# EasyEDA Pro project ProPrj_Xen_2025-02-04.epro, schematic Controller

## Sheets
1 Teensy: Board Name: 1. XenControl; Create Date: 2025-01-25; Page Name: Teensy; Project Name: Xen; Schematic Name: Controller; Update Date: 2025-02-04; Company: EasyEDA.com; Drawn: EasyEDA; Page Size: A4; Part Number: JLCPCB-002; Reviewed: EasyEDA; Version: V0.1
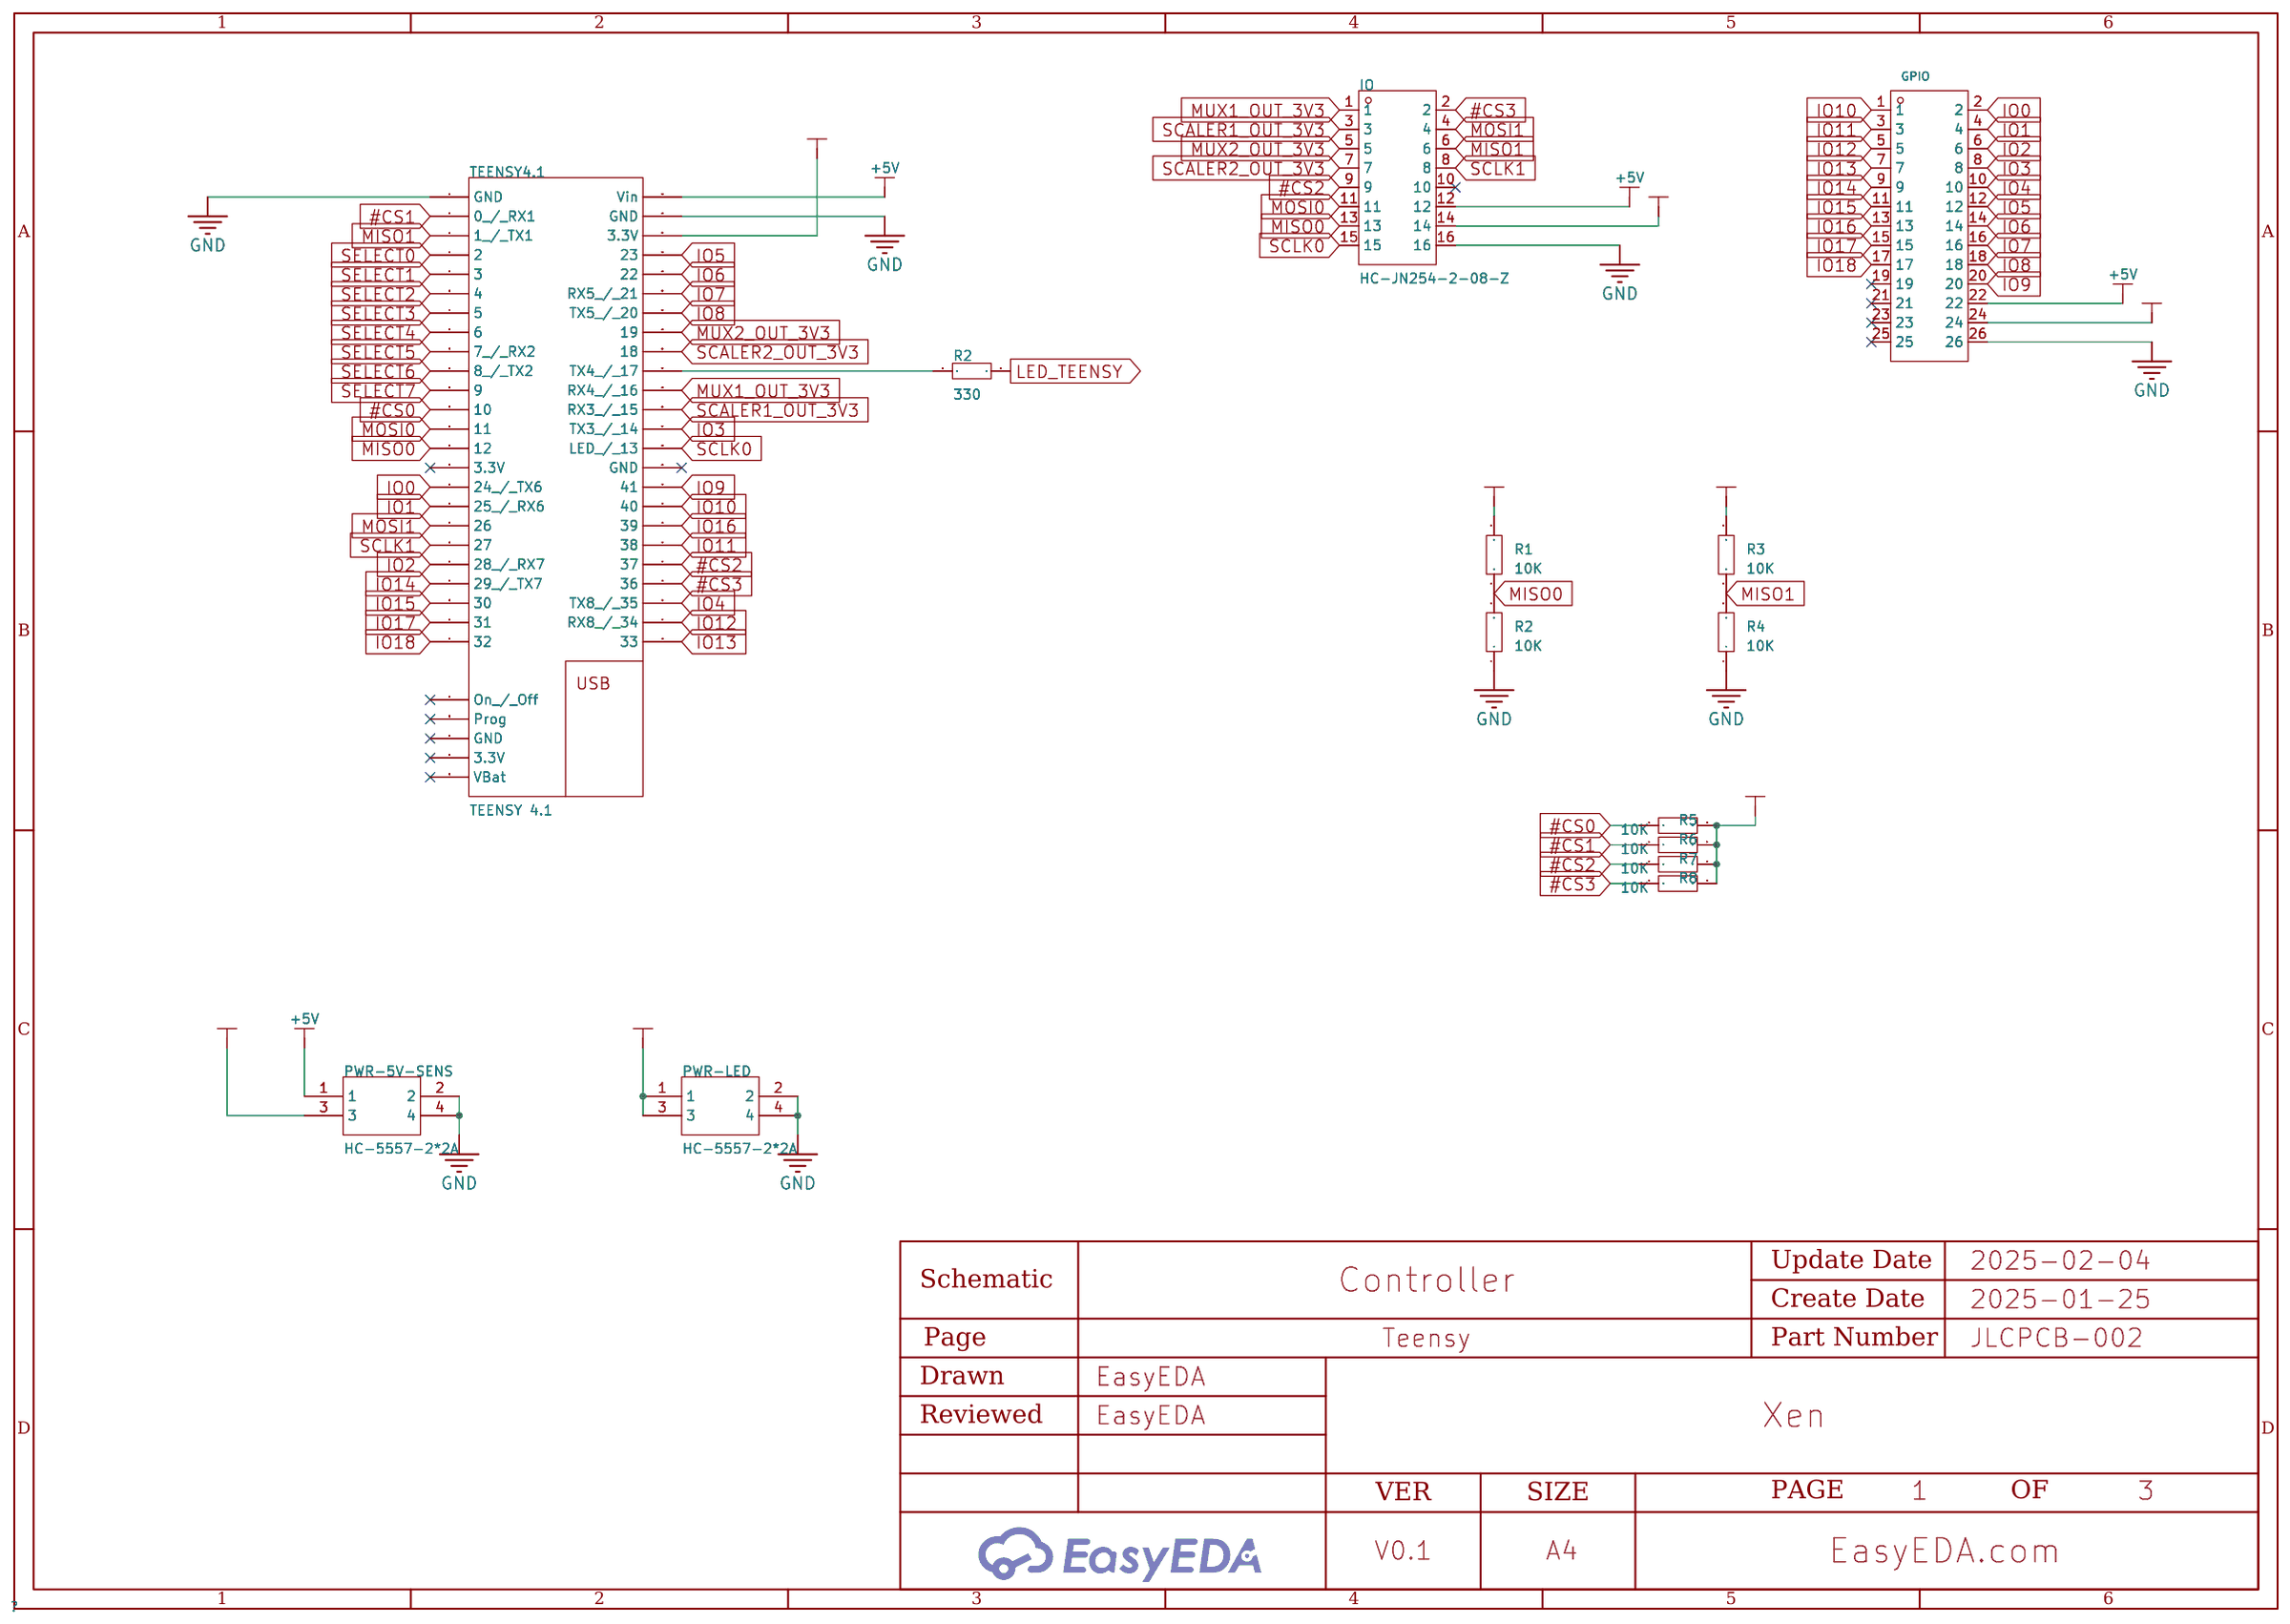
[diagram p23: Teensy]
2 Connect: Create Date: 2025-02-04; Page Name: Connect
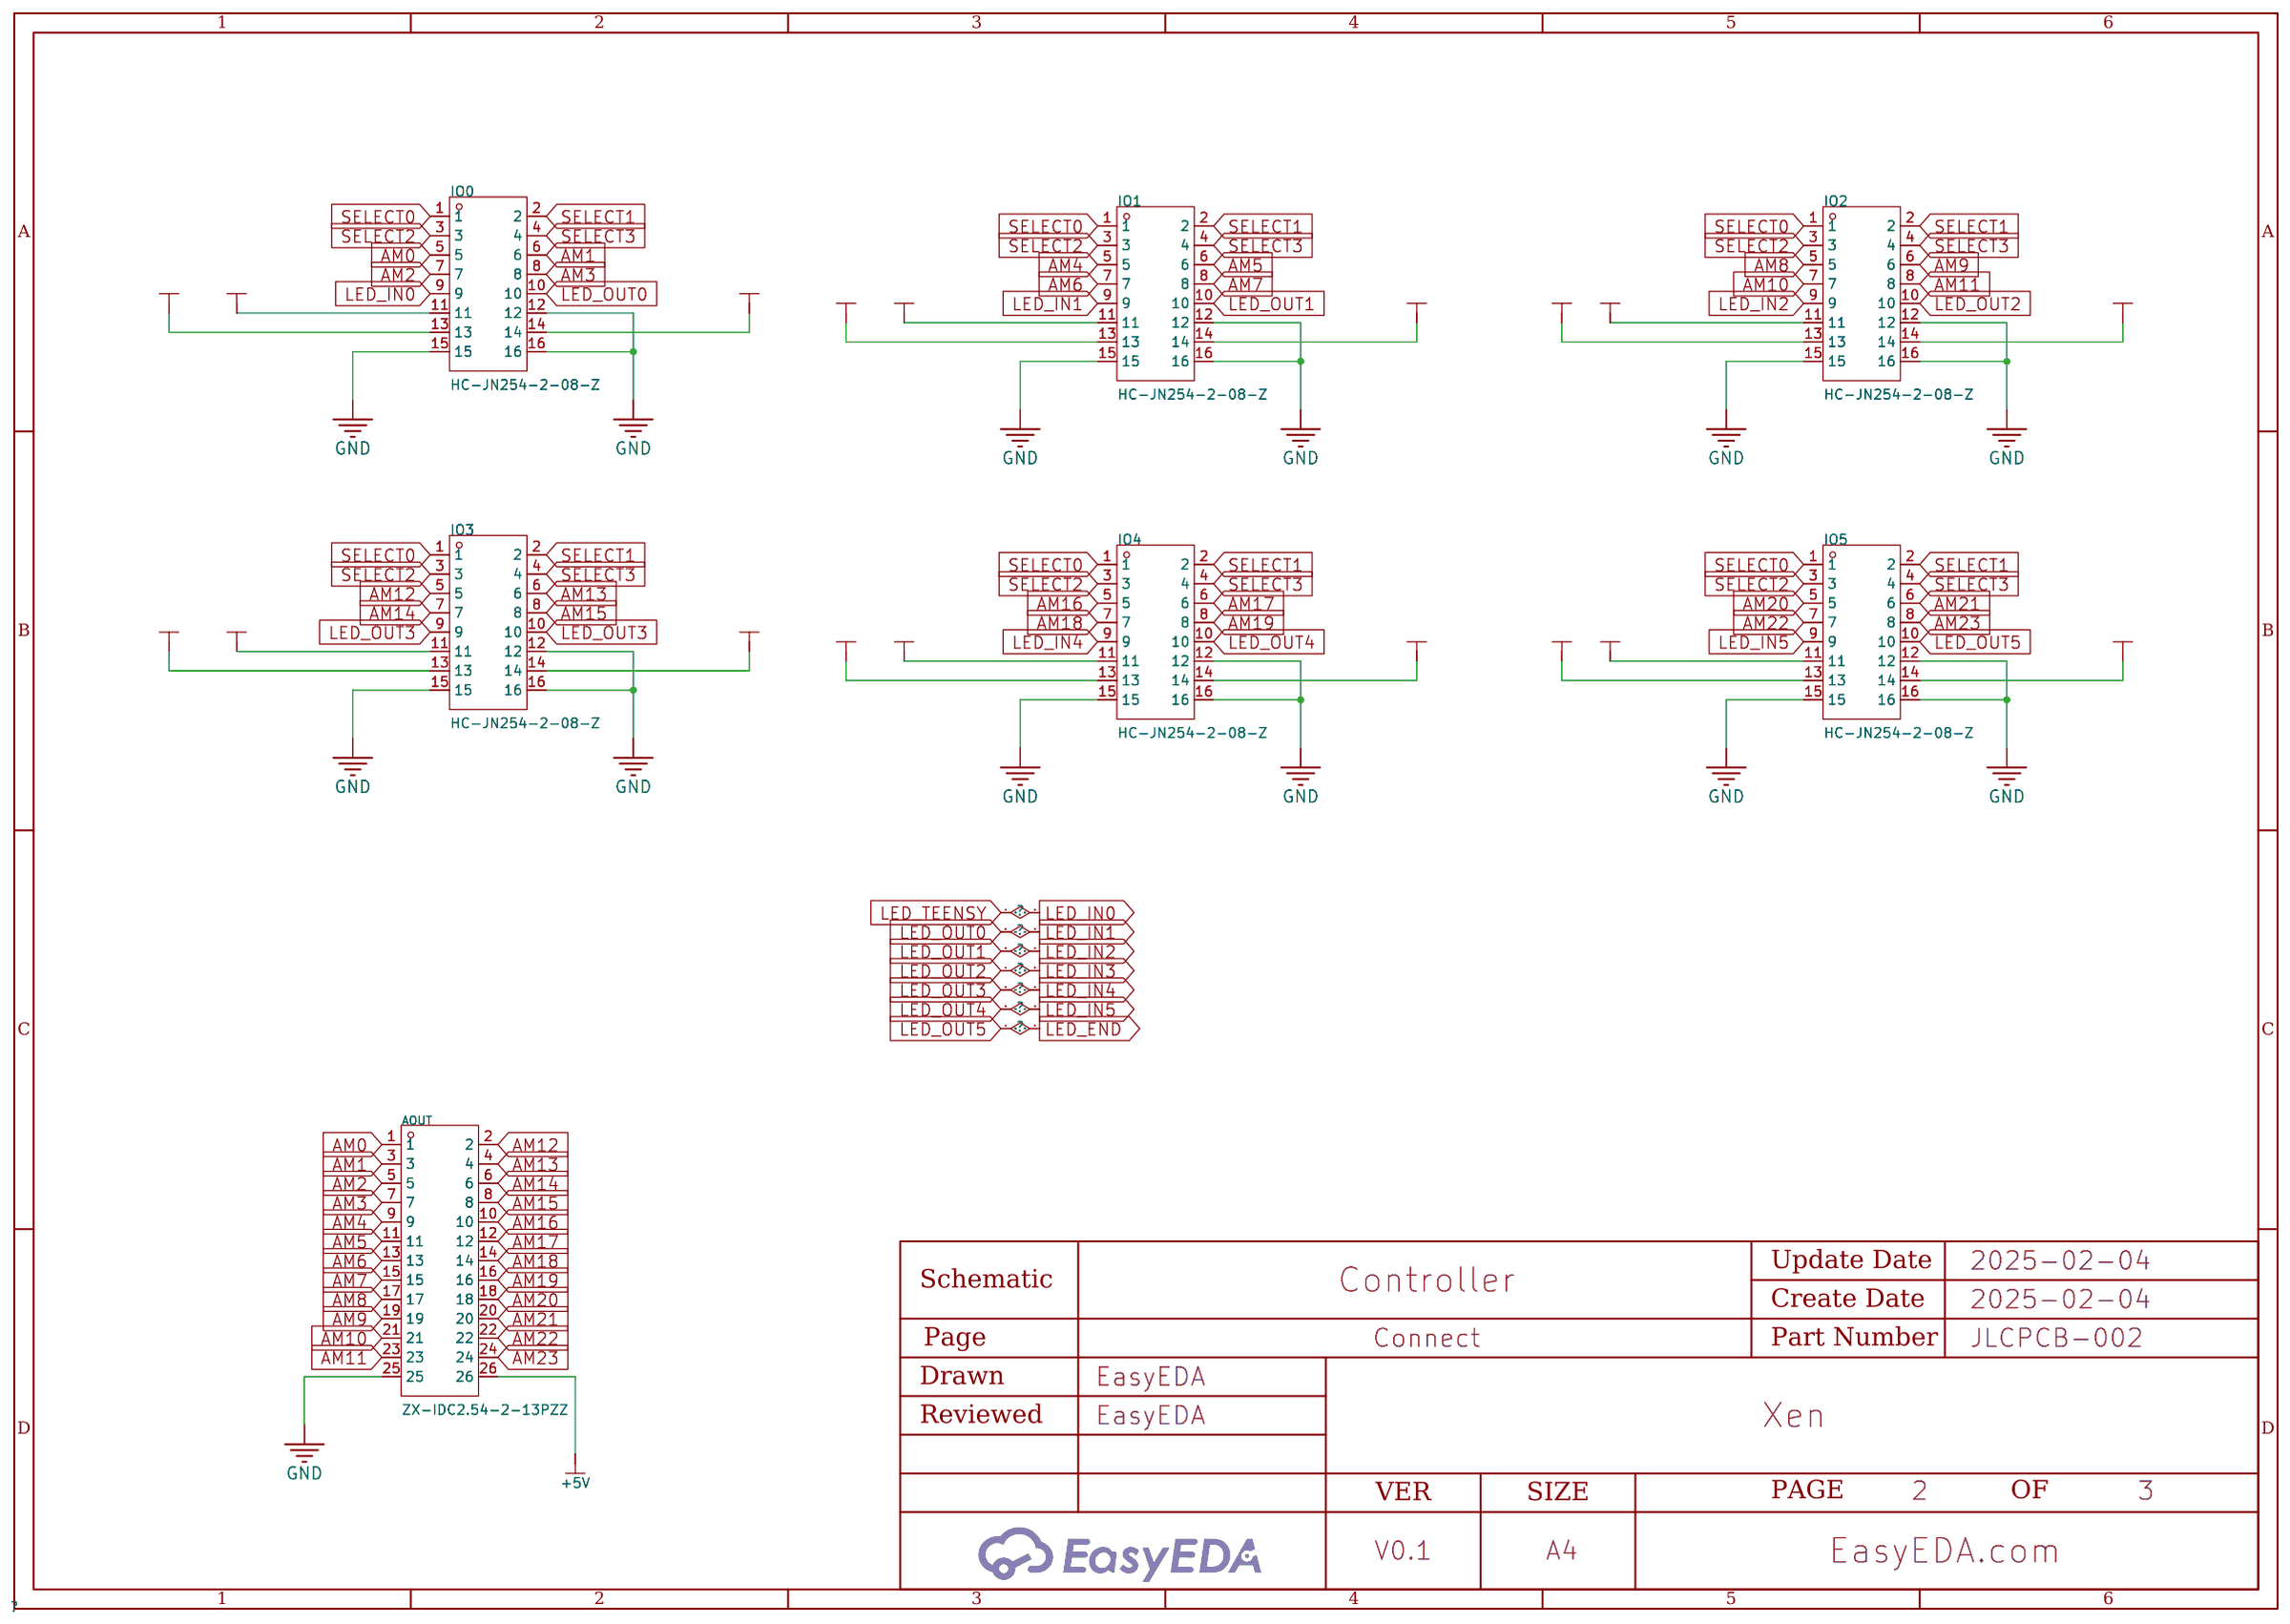
[diagram p24: Connect]
3 Mux: Create Date: 2025-02-04; Page Name: Mux
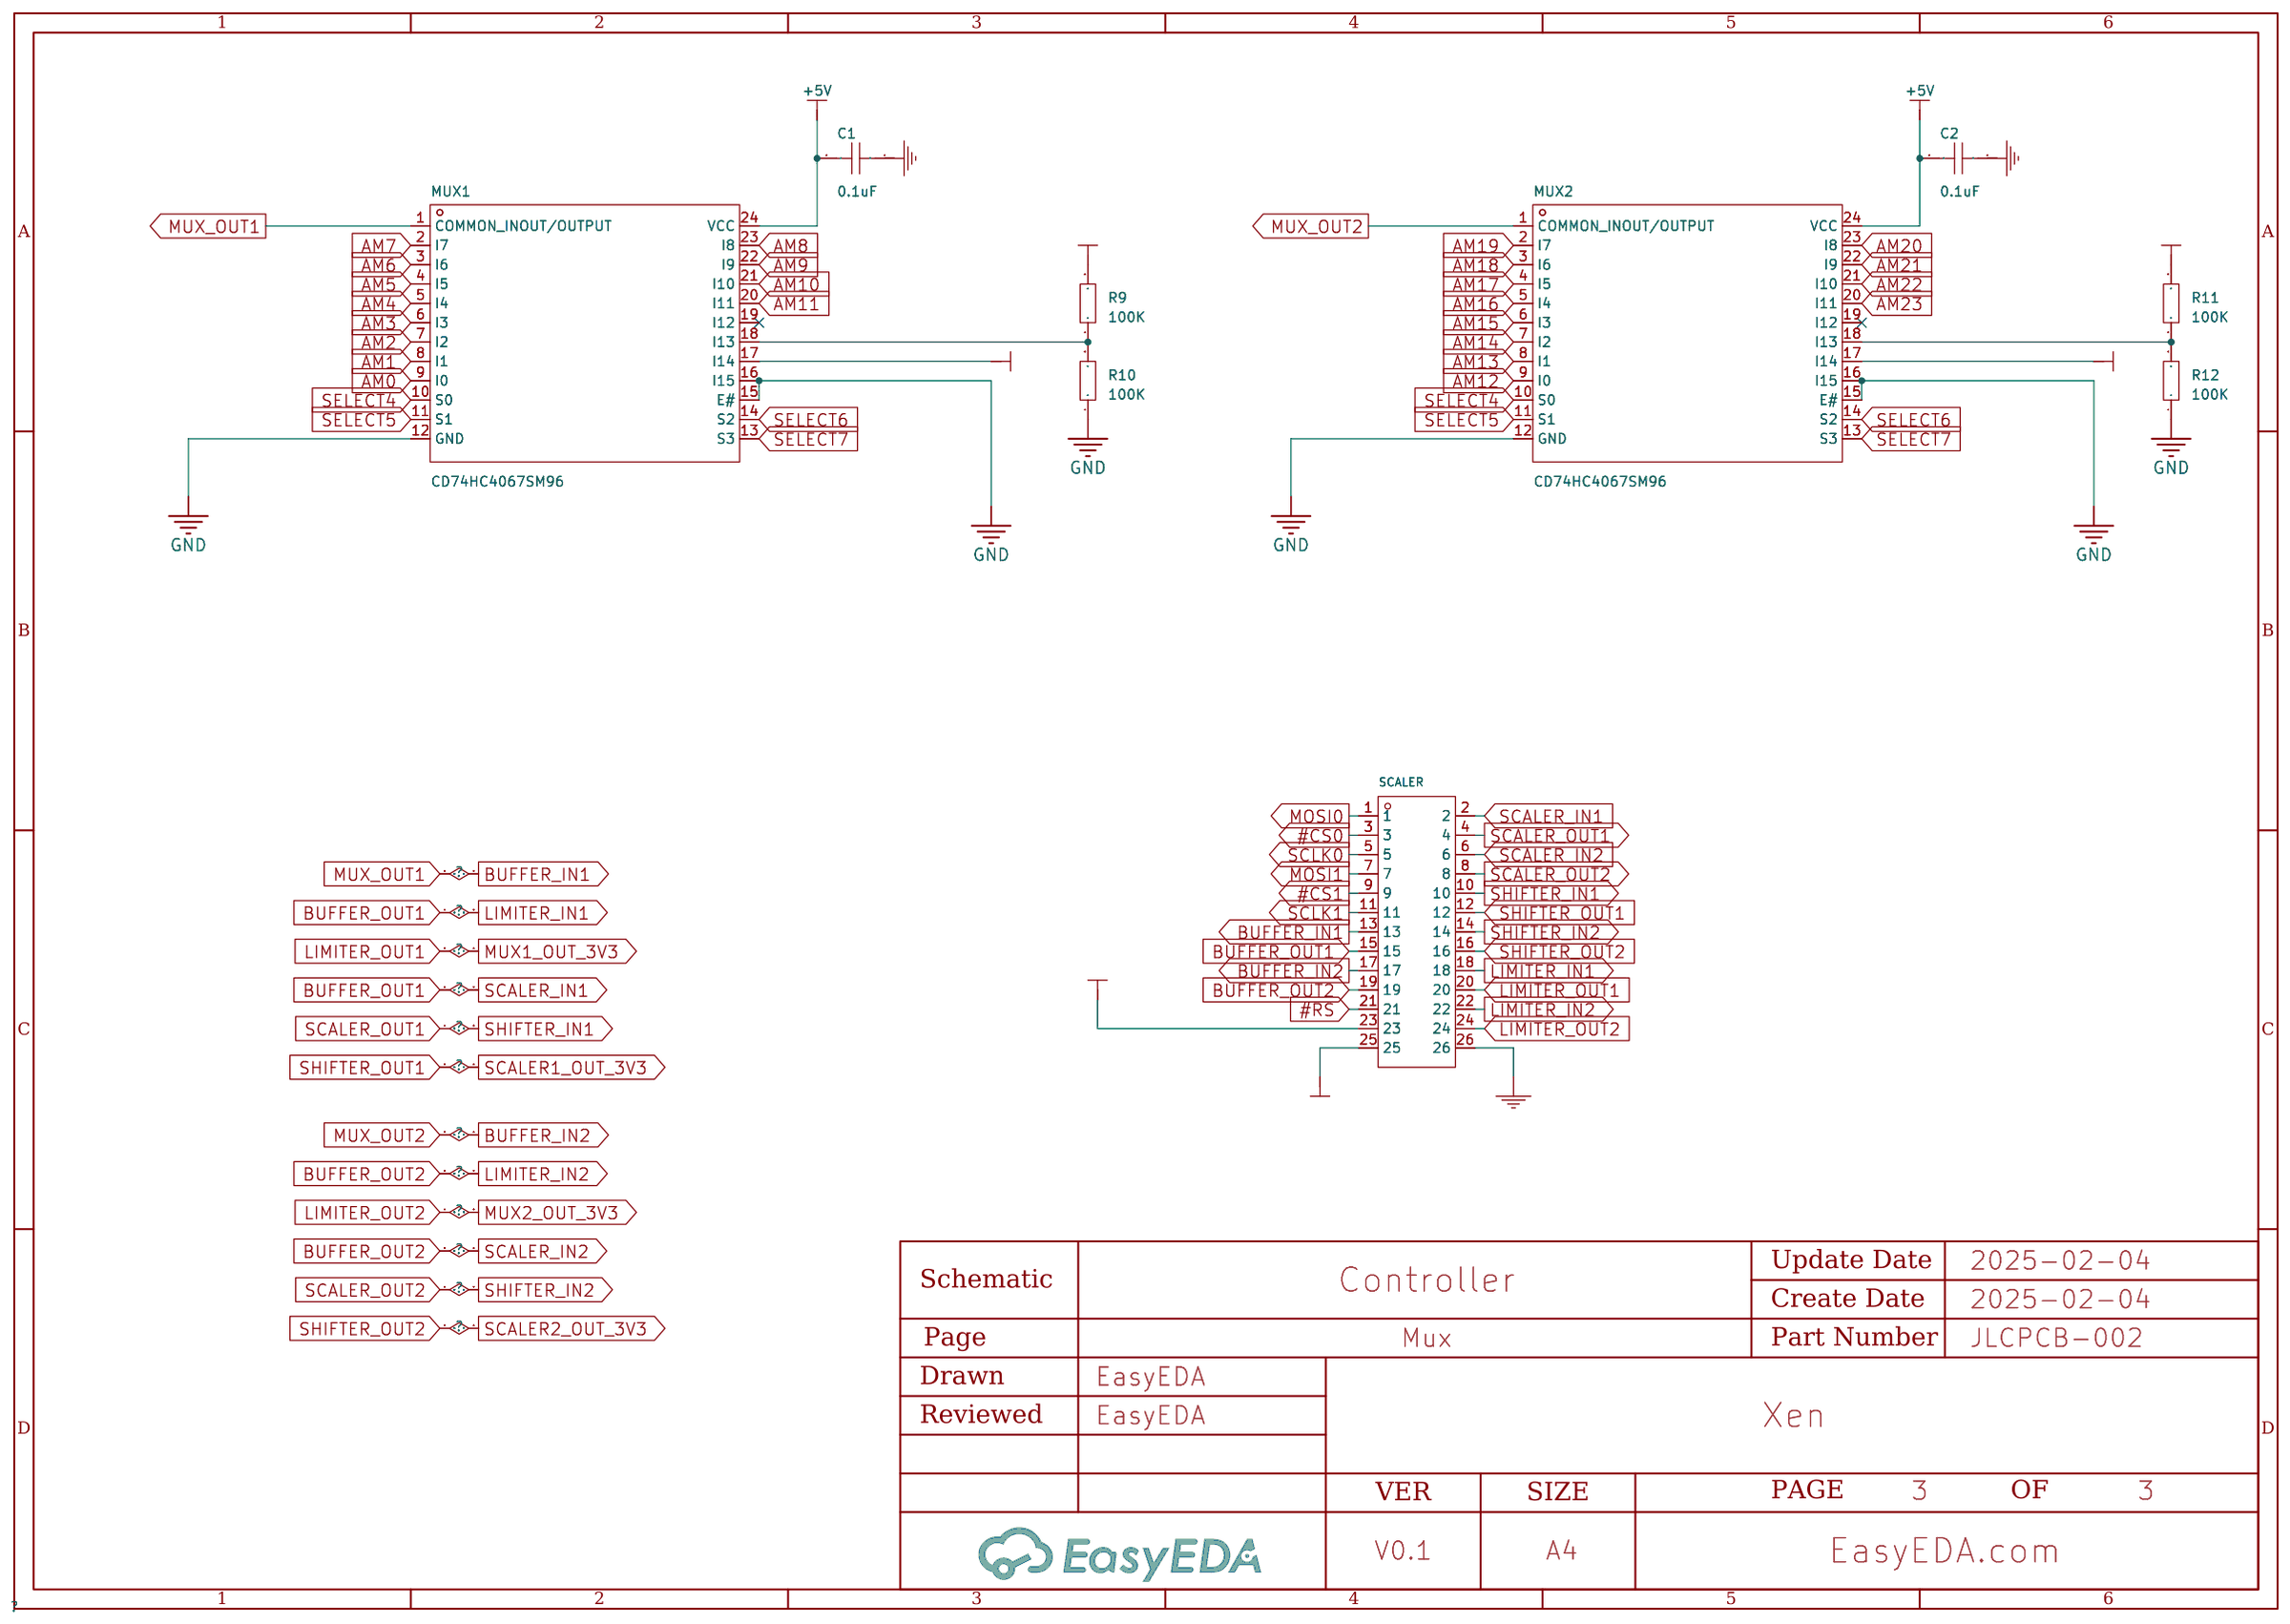
[diagram p25: Mux]

## Parts
sheet Connect
AOUT  ZX-IDC2.54-2-13PZZ  [IDC-TH_26P-P2.54_ZX-IDC2.54-2-13PZZ]
IO0  HC-JN254-2-08-Z  [CONN-TH_16P-P2.54_TE_1761681-6]
IO1  HC-JN254-2-08-Z  [CONN-TH_16P-P2.54_TE_1761681-6]
IO2  HC-JN254-2-08-Z  [CONN-TH_16P-P2.54_TE_1761681-6]
IO3  HC-JN254-2-08-Z  [CONN-TH_16P-P2.54_TE_1761681-6]
IO4  HC-JN254-2-08-Z  [CONN-TH_16P-P2.54_TE_1761681-6]
IO5  HC-JN254-2-08-Z  [CONN-TH_16P-P2.54_TE_1761681-6]
sheet Mux
C1  0.1uF  [C0603]
C2  0.1uF  [C0603]
MUX1  CD74HC4067SM96  [SSOP-24_L8.1-W5.3-P0.65-LS7.8-BL]
MUX2  CD74HC4067SM96  [SSOP-24_L8.1-W5.3-P0.65-LS7.8-BL]
R9  100K  [R0603]
R10  100K  [R0603]
R11  100K  [R0603]
R12  100K  [R0603]
SCALER  ZX-IDC2.54-2-13PZZ  [IDC-TH_26P-P2.54_ZX-IDC2.54-2-13PZZ]
sheet Teensy
GPIO  ZX-IDC2.54-2-13PZZ  [IDC-TH_26P-P2.54_ZX-IDC2.54-2-13PZZ]
IO  HC-JN254-2-08-Z  [CONN-TH_16P-P2.54_TE_1761681-6]
PWR-5V-SENS  HC-5557-2*2A  [CONN-TH_HAA420A-4A]
PWR-LED  HC-5557-2*2A  [CONN-TH_HAA420A-4A]
R1  10K  [R0603]
R2  330  [R0603]
R2#2  10K  [R0603]
R3  10K  [R0603]
R4  10K  [R0603]
R5  10K  [R0603]
R6  10K  [R0603]
R7  10K  [R0603]
R8  10K  [R0603]
TEENSY4.1  TEENSY 4.1  [TEENSY 4.1]

## Library data of the parts
AOUT GPIO SCALER = ZX-IDC2.54-2-13PZZ: Connector Type:简牛座 Pitch:2.54mm Structure:2x13P Current Rating (Max):3A Voltage Rating (Max):1kV Holder Type:Straight Row Spacing:2.54mm Number of Rows:2 Pin Number in each Row:13 Contact Material:Brass Contact Plating:Gold Operating Temperature Range:-40; LCSC Part Name: 2.54mm 2x13P 排数:2 每排P数:13; Supplier Part: C7501247; Manufacturer: Megastar(兆星); Supplier Footprint: 插件,P=2.54mm; JLCPCB Part Class: Extended Part; Datasheet: https://atta.szlcsc.com/upload/public/pdf/source/20231122/C34A0102EBF117114DD7A9F9DEFF8982.pdf; Supplier: LCSC; Connector Type: 简牛座; Pitch: 2.54mm; Structure: 2x13P; Current Rating (Max): 3A; Voltage Rating (Max): 1kV; Holder Type: Straight; Row Spacing: 2.54mm; Number of Rows: 2; Pin Number in each Row: 13; Contact Material: Brass; Contact Plating: Gold; Operating Temperature Range: -40℃~+105℃; Soldering Temperature(Max): 260℃@10S
IO IO0-IO5 = HC-JN254-2-08-Z: Connector Type:简牛座 Pitch:2.54mm Structure:2x8P Current Rating (Max):3A Holder Type:Straight Row Spacing:2.54mm Number of Rows:2 Pin Number in each Row:8 Contact Material:Brass Contact Plating:Gold Operating Temperature Range:-40℃~+105℃ Operating Temperatu; LCSC Part Name: 2.54mm 2x8P 排数:2 每排P数:8; Supplier Part: C5372867; Manufacturer: HCTL(华灿天禄); Supplier Footprint: 插件,P=2.54mm; JLCPCB Part Class: Extended Part; Datasheet: https://atta.szlcsc.com/upload/public/pdf/source/20230316/69505B1ED1C4E6AD1FC7E030884C6E9A.pdf; Supplier: LCSC; Connector Type: 简牛座; Pitch: 2.54mm; Structure: 2x8P; Current Rating (Max): 3A; Holder Type: Straight; Row Spacing: 2.54mm; Number of Rows: 2; Pin Number in each Row: 8; Contact Material: Brass; Contact Plating: Gold; Operating Temperature Range: -40℃~+105℃; Soldering Temperature(Max): 260℃@10S
C1 C2 = CAP_0603: Supplier Footprint: 0603
MUX1 MUX2 = CD74HC4067SM96: Switch Circuit:- Number of Channels:16 Supply Voltage:2V~6V Supply Voltage:2V~6V Turn-on time:90ns On-State Resistance (Max):240Ω Turn-off time:87ns Operating Temperature:-55℃~+125℃ Operating Temperature:-55℃~+125℃; LCSC Part Name: 高速CMOS逻辑16通道模拟多路复用器/解复用器; Supplier Part: C98457; Manufacturer: TI(德州仪器); Supplier Footprint: SSOP-24-208mil; JLCPCB Part Class: Extended Part; Datasheet: https://www.ti.com/cn/lit/gpn/cd74hc4067; Supplier: LCSC; Number of Channels: 16; Supply Voltage: 2V~6V; Turn-on time: 90ns; On-State Resistance (Max): 240Ω; Turn-off time: 87ns; Operating Temperature: -55℃~+125℃
R1 R2 R2#2 R3-R12 = Res_0603: Supplier Footprint: 0603
PWR-5V-SENS PWR-LED = HC-5557-2*2A: Pins Structure:2x2P Pitch:4.2mm Mounting Style:Direct Insert Reference Series:Mini-Fit(MX 4.2) Number of Pins:4P Number of Rows:2 Number of PINs Per Row:2 Row Spacing:4.2mm Current Rating (Max):9A Contact Material:Brass Contact Plating:Tin Operating Tempe; LCSC Part Name: 2x2P 间距:4.2mm 直插 系列:Mini-Fit(MX 4.2); Supplier Part: C2845777; Manufacturer: HCTL(华灿天禄); Supplier Footprint: 插件,P=4.2mm; JLCPCB Part Class: Extended Part; Datasheet: https://atta.szlcsc.com/upload/public/pdf/source/20230620/FF5B1F4AE343F4430EEB0EA0134778E8.pdf; Supplier: LCSC; Pins Structure: 2x2P; Pitch: 4.2mm; Mounting Style: Direct Insert; Reference Series: Mini-Fit(MX 4.2); Number of Pins: 4P; Number of Rows: 2; Number of PINs Per Row: 2; Row Spacing: 4.2mm; Current Rating (Max): 9A; Contact Material: Brass; Contact Plating: Tin; Operating Temperature Range: -25℃~+85℃; Rated Voltage (Max): 600V; Plastic Material: PA66; Flame Retardant Rating: UL94V-0; Z-Height of the Board: 13.1mm; X-Length of Bottom Edge on Board (Spacing Line): 9.6mm; Y-Width of Bottom Edge on Board: 11.4mm
TEENSY4.1 = TEENSY 4.1

## Nets
+3.3V: GPIO.24 IO.14 R1.2 R3.2 R5.2 R6.2 R7.2 R8.2 SCALER.23 TEENSY4.1.27(3.3V)
+5V: AOUT.26 C1.2 C2.2 GPIO.22 IO.12 MUX1.24(VCC) MUX2.24(VCC) PWR-5V-SENS.1 SCALER.25 TEENSY4.1.25(Vin)
GND: AOUT.25 C1.1 C2.1 GPIO.26 IO.16 IO0.12 IO0.15 IO0.16 IO1.12 IO1.15 IO1.16 IO2.12 IO2.15 IO2.16 IO3.12 IO3.15 IO3.16 IO4.12 IO4.15 IO4.16 IO5.12 IO5.15 IO5.16 MUX1.12(GND) MUX1.15(E#) MUX1.16(I15) MUX2.12(GND) MUX2.15(E#) MUX2.16(I15) PWR-5V-SENS.2 PWR-5V-SENS.4 PWR-LED.2 PWR-LED.4 R2#2.1 R4.1 R10.1 R12.1 SCALER.26 TEENSY4.1.1(GND) TEENSY4.1.26(GND)
#CS0: R5.1 SCALER.3 TEENSY4.1.12(10)
#CS1: R6.1 SCALER.9 TEENSY4.1.2(0 / RX1)
#CS2: IO.9 R7.1 TEENSY4.1.44(37)
#CS3: IO.2 R8.1 TEENSY4.1.45(36)
#RS: SCALER.21
AM0: AOUT.1 IO0.5 MUX1.9(I0)
AM1: AOUT.3 IO0.6 MUX1.8(I1)
AM2: AOUT.5 IO0.7 MUX1.7(I2)
AM3: AOUT.7 IO0.8 MUX1.6(I3)
AM4: AOUT.9 IO1.5 MUX1.5(I4)
AM5: AOUT.11 IO1.6 MUX1.4(I5)
AM6: AOUT.13 IO1.7 MUX1.3(I6)
AM7: AOUT.15 IO1.8 MUX1.2(I7)
AM8: AOUT.17 IO2.5 MUX1.23(I8)
AM9: AOUT.19 IO2.6 MUX1.22(I9)
AM10: AOUT.21 IO2.7 MUX1.21(I10)
AM11: AOUT.23 IO2.8 MUX1.20(I11)
AM12: AOUT.2 IO3.5 MUX2.9(I0)
AM13: AOUT.4 IO3.6 MUX2.8(I1)
AM14: AOUT.6 IO3.7 MUX2.7(I2)
AM15: AOUT.8 IO3.8 MUX2.6(I3)
AM16: AOUT.10 IO4.5 MUX2.5(I4)
AM17: AOUT.12 IO4.6 MUX2.4(I5)
AM18: AOUT.14 IO4.7 MUX2.3(I6)
AM19: AOUT.16 IO4.8 MUX2.2(I7)
AM20: AOUT.18 IO5.5 MUX2.23(I8)
AM21: AOUT.20 IO5.6 MUX2.22(I9)
AM22: AOUT.22 IO5.7 MUX2.21(I10)
AM23: AOUT.24 IO5.8 MUX2.20(I11)
BUFFER_IN1: MUX1.1(COMMON INOUT/OUTPUT) SCALER.13
BUFFER_IN2: MUX2.1(COMMON INOUT/OUTPUT) SCALER.17
BUFFER_OUT1: SCALER.2 SCALER.15 SCALER.18
BUFFER_OUT2: SCALER.6 SCALER.19 SCALER.22
IO0: GPIO.2 TEENSY4.1.16(24 / TX6)
IO1: GPIO.4 TEENSY4.1.17(25 / RX6)
IO2: GPIO.6 TEENSY4.1.20(28 / RX7)
IO3: GPIO.8 TEENSY4.1.37(TX3 / 14)
IO4: GPIO.10 TEENSY4.1.46(TX8 / 35)
IO5: GPIO.12 TEENSY4.1.28(23)
IO6: GPIO.14 TEENSY4.1.29(22)
IO7: GPIO.16 TEENSY4.1.30(RX5 / 21)
IO8: GPIO.18 TEENSY4.1.31(TX5 / 20)
IO9: GPIO.20 TEENSY4.1.40(41)
IO10: GPIO.1 TEENSY4.1.41(40)
IO11: GPIO.3 TEENSY4.1.43(38)
IO12: GPIO.5 TEENSY4.1.47(RX8 / 34)
IO13: GPIO.7 TEENSY4.1.48(33)
IO14: GPIO.9 TEENSY4.1.21(29 / TX7)
IO15: GPIO.11 TEENSY4.1.22(30)
IO16: GPIO.13 TEENSY4.1.42(39)
IO17: GPIO.15 TEENSY4.1.23(31)
IO18: GPIO.17 TEENSY4.1.24(32)
LED_END: IO5.10
LED_IN0: IO0.9 R2.1
LED_IN1: IO0.10 IO1.9
LED_IN2: IO1.10 IO2.9
LED_IN3: IO2.10
LED_IN4: IO3.9 IO3.10 IO4.9
LED_IN5: IO4.10 IO5.9
LIMITER_OUT1: IO.1 SCALER.20 TEENSY4.1.35(RX4 / 16)
LIMITER_OUT2: IO.5 SCALER.24 TEENSY4.1.32(19)
MISO0: IO.13 R1.1 R2#2.2 TEENSY4.1.14(12)
MISO1: IO.6 R3.1 R4.2 TEENSY4.1.3(1 / TX1)
MOSI0: IO.11 SCALER.1 TEENSY4.1.13(11)
MOSI1: IO.4 SCALER.7 TEENSY4.1.18(26)
SCALER1_OUT_3V3: IO.3 SCALER.12 TEENSY4.1.36(RX3 / 15)
SCALER2_OUT_3V3: IO.7 SCALER.16 TEENSY4.1.33(18)
SCALER_OUT1: SCALER.4 SCALER.10
SCALER_OUT2: SCALER.8 SCALER.14
SCLK0: IO.15 SCALER.5 TEENSY4.1.38(LED / 13)
SCLK1: IO.8 SCALER.11 TEENSY4.1.19(27)
SELECT0: IO0.1 IO1.1 IO2.1 IO3.1 IO4.1 IO5.1 TEENSY4.1.4(2)
SELECT1: IO0.2 IO1.2 IO2.2 IO3.2 IO4.2 IO5.2 TEENSY4.1.5(3)
SELECT2: IO0.3 IO1.3 IO2.3 IO3.3 IO4.3 IO5.3 TEENSY4.1.6(4)
SELECT3: IO0.4 IO1.4 IO2.4 IO3.4 IO4.4 IO5.4 TEENSY4.1.7(5)
SELECT4: MUX1.10(S0) MUX2.10(S0) TEENSY4.1.8(6)
SELECT5: MUX1.11(S1) MUX2.11(S1) TEENSY4.1.9(7 / RX2)
SELECT6: MUX1.14(S2) MUX2.14(S2) TEENSY4.1.10(8 / TX2)
SELECT7: MUX1.13(S3) MUX2.13(S3) TEENSY4.1.11(9)
VLED: IO0.13 IO0.14 IO1.13 IO1.14 IO2.13 IO2.14 IO3.13 IO3.14 IO4.13 IO4.14 IO5.13 IO5.14 PWR-LED.1 PWR-LED.3
VSENSOR: IO0.11 IO1.11 IO2.11 IO3.11 IO4.11 IO5.11 MUX1.17(I14) MUX2.17(I14) PWR-5V-SENS.3 R9.2 R11.2
$1N741: R2.2 TEENSY4.1.34(TX4 / 17)
Net-(MUX1-18): MUX1.18(I13) R9.1 R10.2
Net-(MUX2-18): MUX2.18(I13) R11.1 R12.2

Not connected (* = marked no-connect by the designer): GPIO 19* 21* 23* 25*; IO 10*; MUX1 19(I12)*; MUX2 19(I12)*; TEENSY4.1 15(3.3V)* 39(GND)* 49(On / Off)* 50(Prog)* 51(GND)* 52(3.3V)* 53(VBat)*
